# EAGLE design spi_lcd_v3 (EAGLE 6.1)
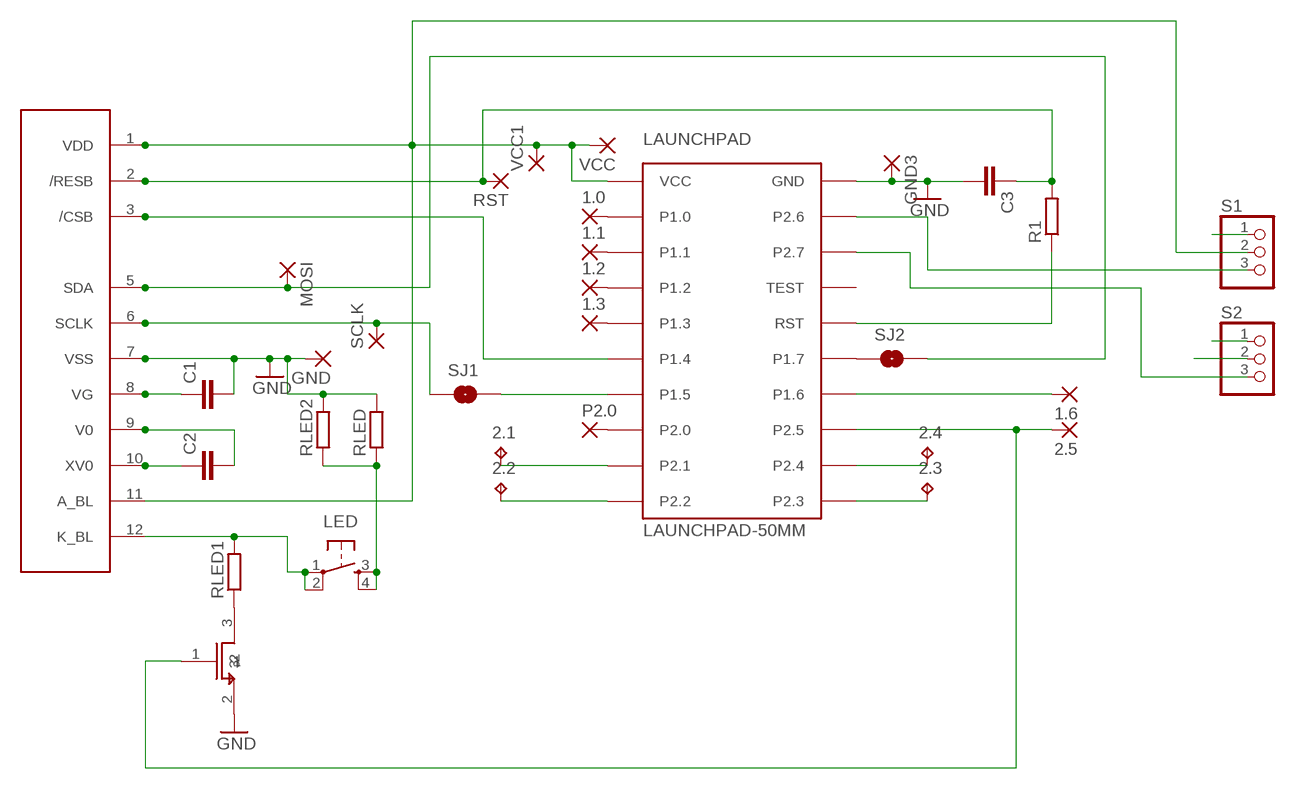
[diagram p0: schematic, sheet 1]

## Parts
1.0  2,15/1,0  [2,15/1,0]
1.1  2,15/1,0  [2,15/1,0]
1.2  2,15/1,0  [2,15/1,0]
1.3  2,15/1,0  [2,15/1,0]
1.6  2,15/1,0  [2,15/1,0]
2.1  TPTP07R  [TP07R]
2.2  TPTP07R  [TP07R]
2.3  TPTP07R  [TP07R]
2.4  TPTP07R  [TP07R]
2.5  2,15/1,0  [2,15/1,0]
C1  CAP1206  [1206]
C2  CAP1206  [1206]
C3  CAP1206  [1206]
GND  2,15/1,0  [2,15/1,0]
GND3  2,15/1,0  [2,15/1,0]
LAUNCHPAD  LAUNCHPAD-50MM  [LAUNCHPAD-50MM]
LED  TAC_SWITCHPTH  [TACTILE-PTH]
LEDSW  2N7002PW  [SOT323-R]
MOSI  2,15/1,0  [2,15/1,0]
P2.0  2,15/1,0  [2,15/1,0]
R1  R-EU_R1206  [R1206]
RLED  R-EU_R1206  [R1206]
RLED1  R-EU_R1206  [R1206]
RLED2  R-EU_0207/7  [0207/7]
RST  2,15/1,0  [2,15/1,0]
S1  PINHD-1X3  [1X03]
S2  PINHD-1X3  [1X03]
SCLK  2,15/1,0  [2,15/1,0]
SJ1  SOLDERJUMPERTRACE  [SJ_2S-TRACE]
SJ2  SOLDERJUMPERTRACE  [SJ_2S-TRACE]
U$1  PE9665WRFPE9665WRF-WHOLE  [PE9665WRF]
VCC  2,15/1,0  [2,15/1,0]
VCC1  2,15/1,0  [2,15/1,0]

## Nets
GND: C1.2 C3.2 GND3.1(P) GND.1(P) LAUNCHPAD.GND LEDSW.2 RLED2.2 RLED.2 S1.1 S2.1 U$1.7(VSS)
N$1: C2.1 U$1.10(XV0)
N$2: C2.2 U$1.9(V0)
N$3: C1.1 U$1.8(VG)
N$4: 2.5.1(P) LAUNCHPAD.P2.5 LEDSW.1
N$5: C3.1 R1.2 RST.1(P) U$1.2(/RESB)
N$6: 1.0.1(P) LAUNCHPAD.P1.0
N$7: SCLK.1(P) SJ1.1 U$1.6(SCLK)
N$8: MOSI.1(P) SJ2.2 U$1.5(SDA)
N$9: LAUNCHPAD.P1.4 U$1.3(/CSB)
N$10: LAUNCHPAD.RST R1.1
N$11: 1.6.1(P) LAUNCHPAD.P1.6
N$12: 1.2.1(P) LAUNCHPAD.P1.2
N$13: 2.1.TP LAUNCHPAD.P2.1
N$14: 2.2.TP LAUNCHPAD.P2.2
N$15: 2.4.TP LAUNCHPAD.P2.4
N$16: 2.3.TP LAUNCHPAD.P2.3
N$17: 1.3.1(P) LAUNCHPAD.P1.3
N$18: LAUNCHPAD.P2.0 P2.0.1(P)
N$19: 1.1.1(P) LAUNCHPAD.P1.1
N$20: LAUNCHPAD.P1.7 SJ2.1
N$21: LAUNCHPAD.P1.5 SJ1.2
N$22: LEDSW.3 RLED1.1
N$23: LAUNCHPAD.P2.7 S2.3
N$24: LED.3 LED.4 RLED2.1 RLED.1
N$25: LED.1 LED.2 RLED1.2 U$1.12(K_BL)
N$26: LAUNCHPAD.P2.6 S1.3
VCC: LAUNCHPAD.VCC S1.2 S2.2 U$1.1(VDD) U$1.11(A_BL) VCC1.1(P) VCC.1(P)
Unconnected: LAUNCHPAD.TEST

## Library data of the parts
1.0 1.1-1.3 1.6 2.5 GND GND3 MOSI P2.0 RST SCLK VCC VCC1 = wirepad:2,15/1,0: THROUGH-HOLE PAD
2.1-2.4 = testpad:TP: Test pad
C1-C3 = SparkFun:CAP: Capacitor Standard 0603 ceramic capacitor, and 0.1" leaded capacitor.
LAUNCHPAD = TI_launchpad:LAUNCHPAD: MSP-EXP430G2 LaunchPad Booster Pack layouts. LAUNCHPAD: Full-size board LAUNCHPAD-50MM: 50x50mm board covering the button area LAUNCHPAD-50MM-LEFT: 50x50mm board leaving the button area open. Tall LaunchPad components marked on Reference for reference.
LED = SparkFun-Electromechanical:TAC_SWITCH: Momentary Switch Button commonly used for reset or general input. Spark Fun Electronics SKU : COM-00097
LEDSW = apus-spidisplay:2N7002PW
R1 RLED RLED1 RLED2 = resistor:R-EU_: RESISTOR, European symbol
S1 S2 = adafruit:PINHD-1X3: PIN HEADER
SJ1 SJ2 = SparkFun-Passives:SOLDERJUMPER: Solder Jumper Standard SMD solder jumper. Used to automate production. Two varients : Normally Open and Normally Closed are the same, but have different paste layers. NC will have a large amount of paste and should jumper during reflow.
U$1 = apus-spidisplay:PE9665WRF

## Board
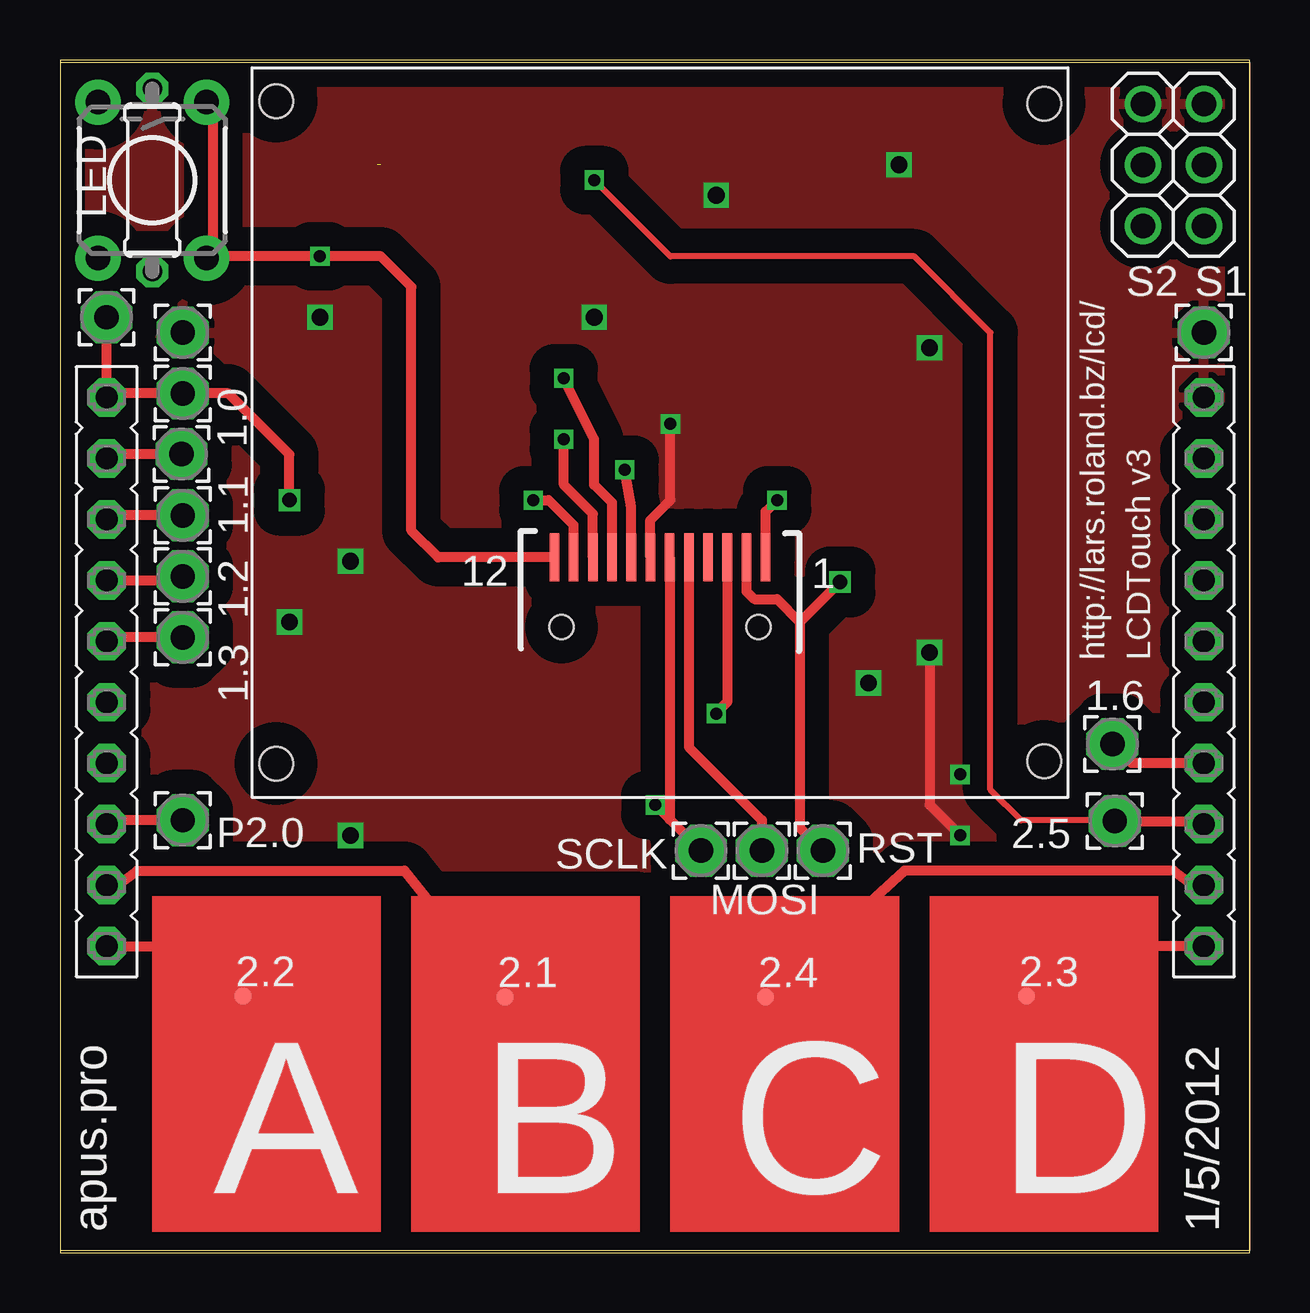
[diagram p1: board, top side]
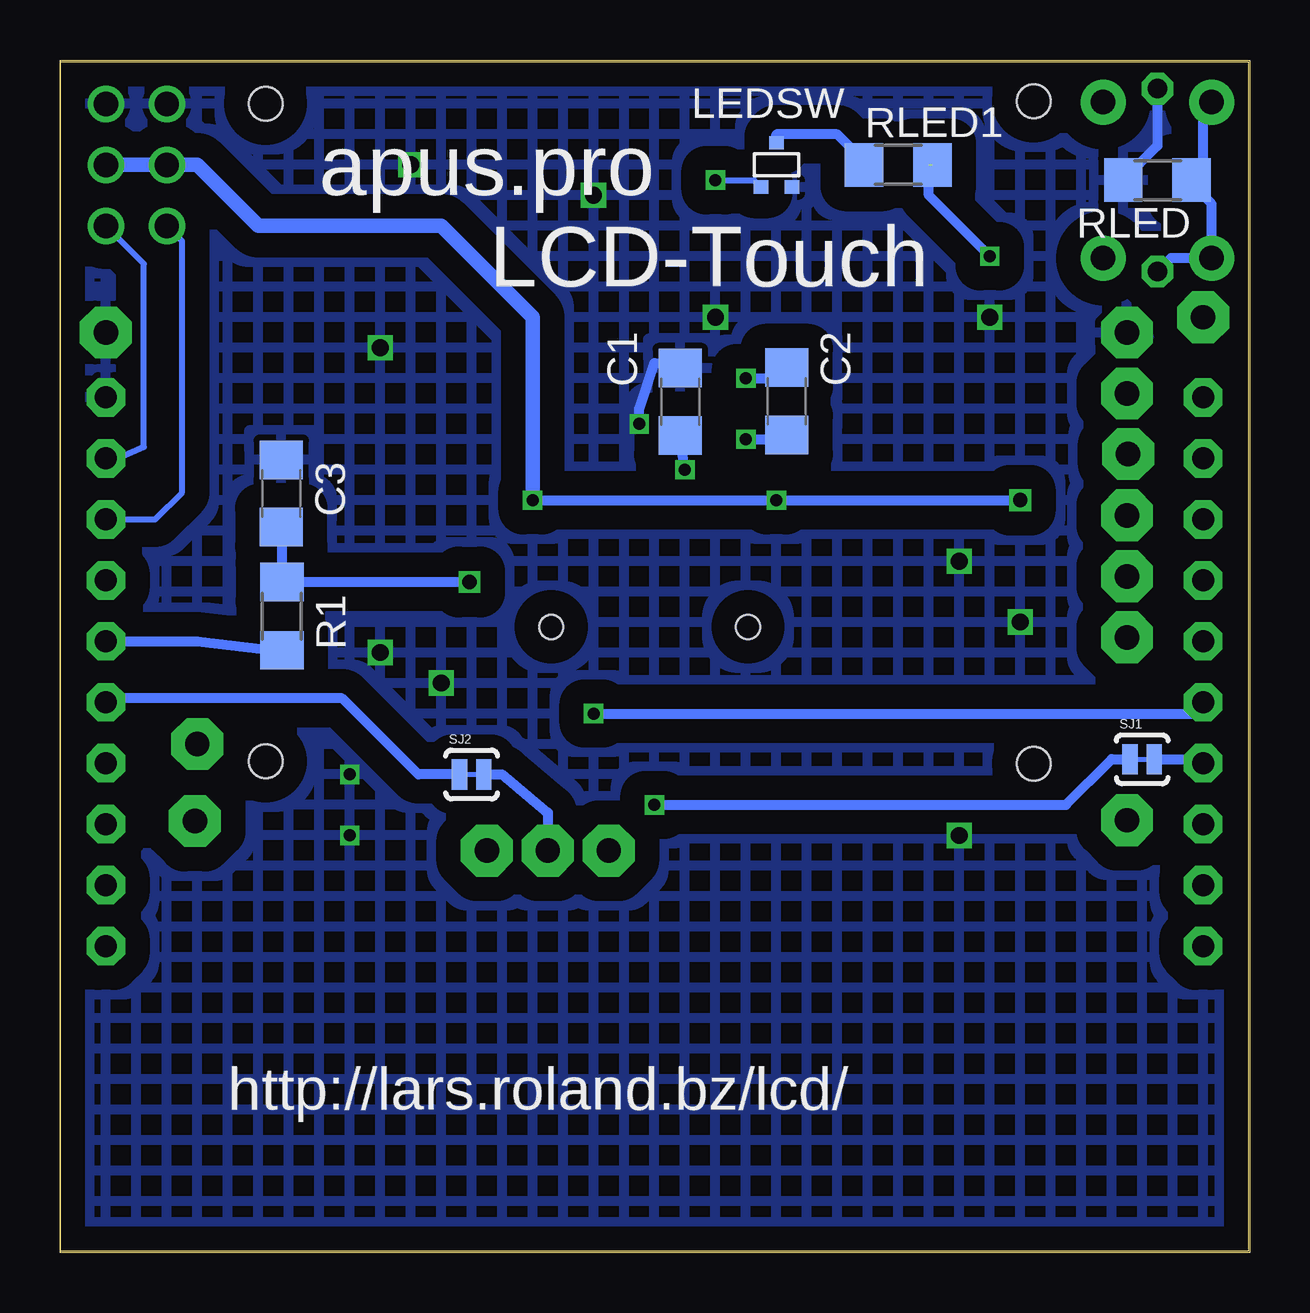
[diagram p2: board, bottom side, seen from below]

Size 49.57 x 49.69 mm. Coordinates in mm from the lower left corner, seen from the top.
Outline: 0,0 49.57,0 49.57,49.69 0,49.69 0,0
Copper layers (1*16): Top 0.035mm / dielectric 1.5mm / Bottom 0.035mm
Design rules: minimum track width 6mil, minimum drill 12mil, track to track 6mil, track to pad 6mil, pad to pad 6mil, via to via 6mil, smd to smd 0mil, copper to edge 10mil, drill to drill 10mil, minimum pad ring 10mil, minimum via ring 6mil, stop-mask expansion 2mil, vias tented up to drill 100mil, thermal gap 10mil

### Footprints (pad centres in the part's own frame; a part is rotated, then mirrored left to right if it is on the bottom)
2,15/1,0 = drill 1.016 pad 2.159 octagon: 1 0,0
TP07R = smd 0.7 x 0.7: TP 0,0
1206 = smd 1.6 x 1.8: 1 -1.4,0; 2 1.4,0
LAUNCHPAD-50MM = drill 0.914 pad 1.6 octagon: GND 13.97,48.26; P1.0 16.51,2.54; P1.1 19.05,2.54; P1.2 21.59,2.54; P1.3 24.13,2.54; P1.4 26.67,2.54; P1.5 29.21,2.54; P1.6 29.21,48.26; P1.7 26.67,48.26; P2.0 31.75,2.54; P2.1 34.29,2.54; P2.2 36.83,2.54; P2.3 36.83,48.26; P2.4 34.29,48.26; P2.5 31.75,48.26; P2.6 16.51,48.26; P2.7 19.05,48.26; RST 24.13,48.26; TEST 21.59,48.26; VCC 13.97,2.54
TACTILE-PTH = drill 1.016 pad 1.88: 1 -3.251,2.261; 2 3.251,2.261; 3 -3.251,-2.261; 4 3.251,-2.261
SOT323-R = smd 0.6 x 0.55: 1 -0.65,-0.925; 2 0.65,-0.925; 3 0,0.925
R1206 = smd 1.6 x 1.803: 1 -1.422,0; 2 1.422,0
0207/7 = drill 0.813 octagon: 1 -3.81,0; 2 3.81,0
1X03 = drill 1.016: 1 -2.54,0; 2 0,0; 3 2.54,0
SJ_2S-TRACE = smd 0.635 x 1.27: 1 -0.508,0; 2 0.508,0
PE9665WRF = smd 0.4 x 2: 1 4.4,0; 2 3.6,0; 3 2.8,0; 4 2,0; 5 1.2,0; 6 0.4,0; 7 -0.4,0; 8 -1.2,0; 9 -2,0; 10 -2.8,0; 11 -3.6,0; 12 -4.4,0 | hole 1: -4.1,-2.9; 4.1,-2.9 | hole 1.4: -16,19; 16,18.9; 16,-8.5; -16,-8.6

### Placement (x,y rotation side)
1.0  5.06,33.27 0 top
1.1  5.12,30.71 0 top
1.2  5.12,28.18 0 top
1.3  5.12,25.64 0 top
1.6  43.85,21.19 0 top
2.1  18.54,10.65 0 top
2.2  7.62,10.68 0 top
2.3  40.27,10.68 0 top
2.4  29.4,10.65 0 top
2.5  43.95,17.98 0 top
C1  23.73,35.45 90 bottom
C2  19.29,35.47 90 bottom
C3  40.35,31.63 90 bottom
GND  47.66,38.34 0 top
GND3  5.12,38.34 0 top
LAUNCHPAD  -0.6,49.6 270 top
LED  3.85,44.69 270 top
LEDSW  19.72,45.32 0 bottom
MOSI  29.24,16.75 0 top
P2.0  5.12,18.02 0 top
R1  40.32,26.52 90 bottom
RLED  3.85,44.69 180 bottom
RLED1  14.64,45.32 0 bottom
RLED2  3.85,44.69 90 top
RST  31.78,16.75 0 top
S1  47.66,45.32 270 top
S2  45.12,45.32 270 top
SCLK  26.7,16.75 0 top
SJ1  4.48,20.55 0 bottom
SJ2  32.42,19.92 0 bottom
U$1  25,28.97 0 top
VCC  1.94,38.97 0 top
VCC1  5.12,35.8 0 top

### Tracks (layer width: path | path; a pad name or v marks a point on that pad's centre or on a via)
GND  (via drill 0.5, 0.7)
  Top 0.406: v36.23,25 36.23,18.65 v37.5,17.38 | U$1.7 24.6,30.52 25.43,31.35 v25.43,34.52
  Bottom 0.406: v25.43,34.52 25.43,35.16 24.8,37.07 23.95,37.07 C1.2 | RLED2.2 3.85,46.11 RLED.2
  other vias: 9.56,26.27 36.23,37.7 22.26,38.97 27.34,44.05 12.1,17.38 37.5,19.92 33.69,23.73 34.96,45.32 10.83,38.97 12.1,28.81
  pour Top (isolate 1.016): 0.67,49.13 48.93,49.13 48.93,0.87 0.67,0.87
  pour Bottom (isolate 1.016, hatched): 0.67,49.13 48.93,49.13 48.93,0.87 0.67,0.87
N$1  (via drill 0.5)
  Top 0.406: U$1.10 22.2,30.78 20.99,31.98 v20.99,33.89
  Bottom 0.406: v20.99,33.89 19.72,33.89 19.54,34.07 C2.1
N$2  (via drill 0.5)
  Top 0.406: U$1.9 23,31.25 22.26,31.98 22.26,33.89 v20.99,36.43
  Bottom 0.406: v20.99,36.43 19.72,36.43 C2.2
N$3  (via drill 0.5)
  Top 0.406: U$1.8 23.8,31.08 v23.53,32.62
  Bottom 0.406: v23.53,32.62 23.53,32.58 C1.1
N$4  (via drill 0.5)
  Top 0.254: 43.92,18.01 40.05,18.01 38.77,19.29 38.77,38.34 35.59,41.51 25.43,41.51 v22.26,44.69
  Top 0.406: 43.92,18.01 2.5.1 47.53,17.98 LAUNCHPAD.P2.5
  Bottom 0.254: v22.26,44.69 20.66,44.69 LEDSW.1
N$5  (via drill 0.6)
  Top 0.406: U$1.2 28.6,27.55 28.93,27.22 29.88,27.22 30.83,26.27 | 30.83,26.27 30.83,17.7 RST.1 | v32.5,27.94 30.83,26.27
  Bottom 0.406: v32.5,27.94 R1.2 40.32,30.23 C3.1
N$6
  Top 0.406: 1.0.1 2.12,33.27 LAUNCHPAD.P1.0
N$7  (via drill 0.5)
  Top 0.406: U$1.6 25.4,18.05 | 25.4,18.05 SCLK.1 | 25.4,18.05 v24.8,18.65
  Bottom 0.406: v24.8,18.65 7.66,18.65 5.75,20.55 SJ1.1
N$8
  Top 0.406: U$1.5 26.2,21.06 29.24,18.02 MOSI.1
  Bottom 0.406: SJ2.2 31.15,19.92 29.24,18.33 MOSI.1
N$9  (via drill 0.5)
  Top 0.406: U$1.3 27.8,22.92 v27.34,22.46
  Top 0.61: 2.29,23.29 1.9,22.9 1.91,22.9 LAUNCHPAD.P1.4
  Bottom 0.406: v27.34,22.46 1.94,22.46 LAUNCHPAD.P1.4
N$10
  Bottom 0.406: LAUNCHPAD.RST 43.85,25.47 40.67,25.1 | R1.1 40.67,25.1 | 40.67,25.1 40.04,25
N$11
  Top 0.406: LAUNCHPAD.P1.6 44.65,20.39 1.6.1
N$12
  Top 0.406: LAUNCHPAD.P1.2 4.95,28.01 1.2.1
N$13
  Top 0.406: LAUNCHPAD.P2.1 2.41,15.31 3.21,15.91 14.35,15.91 2.1.TP
N$14
  Top 0.406: LAUNCHPAD.P2.2 4.58,12.77 2.2.TP
N$15
  Top 0.406: LAUNCHPAD.P2.4 47.19,15.31 46.39,15.91 35.18,15.91 2.4.TP
N$16
  Top 0.406: LAUNCHPAD.P2.3 45.22,12.77 2.3.TP
N$17
  Top 0.406: 1.3.1 2.1,25.64 LAUNCHPAD.P1.3
N$18
  Top 0.406: P2.0.1 2.1,18.02 LAUNCHPAD.P2.0
N$19
  Top 0.406: 1.1.1 2.1,30.71 LAUNCHPAD.P1.1
N$20
  Bottom 0.406: SJ2.1 34.64,19.92 37.82,23.1 47.49,23.1 LAUNCHPAD.P1.7
N$21
  Bottom 0.406: SJ1.2 2.1,20.55 LAUNCHPAD.P1.5
N$22
  Bottom 0.406: RLED1.1 16.06,45.47 17.18,46.59 19.72,46.59 LEDSW.3
N$23
  Bottom 0.254: LAUNCHPAD.P2.7 45.6,30.55 44.48,31.67 44.48,42.15 S2.3
N$24
  Bottom 0.406: 1.94,44.05 1.58,43.69 LED.4 3.29,41.43 RLED2.1 | 1.94,44.05 1.94,47.86 1.66,47.86 LED.3 | RLED.1 2.42,44.53 1.94,44.05
N$25  (via drill 0.5)  (1 unrouted)
  Top 0.406: U$1.12 15.75,28.97 14.64,30.08 14.64,40.24 13.37,41.51 v10.83,41.51 6.39,41.51 | 6.39,41.51 6.39,47.86 6.31,47.94 LED.1 | LED.2 6.31,41.43 6.39,41.51
  Bottom 0.406: v10.83,41.51 13.37,44.05 13.37,45.32
N$26
  Bottom 0.254: LAUNCHPAD.P2.6 47.19,33.09 46.07,33.57 46.07,41.19 S1.3
VCC  (via drill 0.5, 0.6)
  Top 0.406: VCC.1 LAUNCHPAD.VCC 2.1,35.8 VCC1.1 7.02,35.8 9.56,33.26 v9.56,31.35 | U$1.1 29.4,30.87 v29.88,31.35 | v19.72,31.35 20.35,31.35 21.4,30.3 U$1.11
  Bottom 0.406: v29.88,31.35 v19.72,31.35 v9.56,31.35
  Bottom 0.61: v29.88,31.35 29.88,38.97 33.69,42.78 41.31,42.78 43.85,45.32 S2.2 S1.2
(copper drawn outside any net)
  shapes: Top area x4

### Text on the board
tPlace: http://lars.roland.bz/lcd/ | LCDTouch v3 | A | B | C | D | apus.pro | 1/5/2012
bPlace: apus.pro | LCD-Touch | http://lars.roland.bz/lcd/